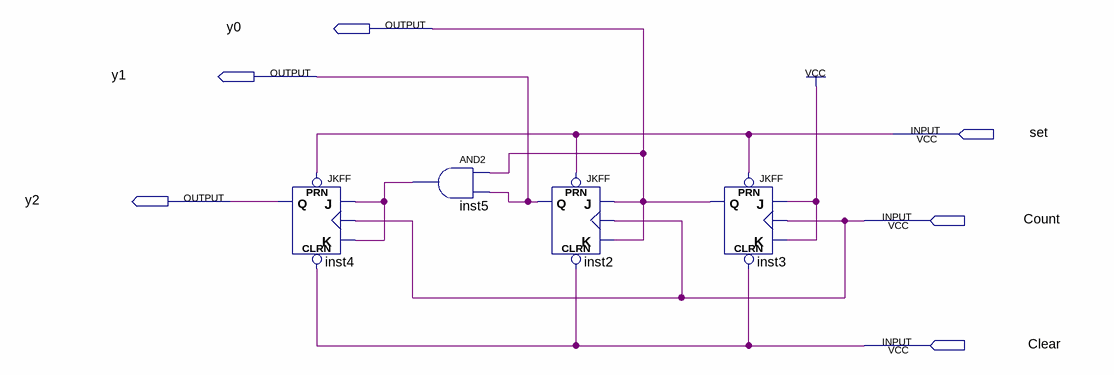
[diagram p0: schematic sheet]
// Quartus schematic bit3BinaryCounter.bdf as structural Verilog: 4 symbols, 6 pins
module bit3BinaryCounter (
  input  set,
  input  Count,
  input  Clear,
  output y0,
  output y1,
  output y2
);

  wire inst5_out;

  JKFF inst4 (.PRN(set), .CLRN(Clear), .K(inst5_out), .J(inst5_out), .CLK(Count), .Q(y2));
  and inst5 (inst5_out, y0, y1);
  JKFF inst2 (.PRN(set), .CLRN(Clear), .K(y0), .J(y0), .CLK(Count), .Q(y1));
  JKFF inst3 (.PRN(set), .CLRN(Clear), .K(1'b1), .J(1'b1), .CLK(Count), .Q(y0));
endmodule
